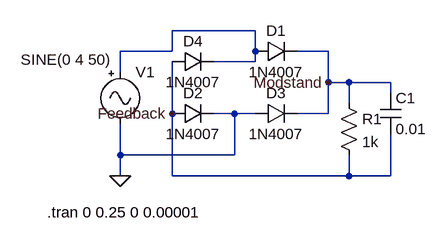
[diagram p0: schematic AEkg2.asc]
AEkg2.asc, the LTspice schematic file:
Version 4
SHEET 1 880 680
WIRE 304 64 176 64
WIRE 176 96 176 64
WIRE 176 96 96 96
WIRE 304 96 304 64
WIRE 416 96 368 96
WIRE 304 112 304 96
WIRE 304 112 240 112
WIRE 96 128 96 96
WIRE 416 144 416 96
WIRE 448 144 416 144
WIRE 512 144 448 144
WIRE 512 160 512 144
WIRE 448 176 448 144
WIRE 176 192 176 112
WIRE 272 192 240 192
WIRE 304 192 272 192
WIRE 416 192 416 144
WIRE 416 192 368 192
WIRE 96 256 96 208
WIRE 272 256 272 192
WIRE 272 256 96 256
WIRE 96 288 96 256
WIRE 176 288 176 192
WIRE 448 288 448 256
WIRE 448 288 176 288
WIRE 512 288 512 224
WIRE 512 288 448 288
FLAG 96 288 0
FLAG 176 192 Feedback
FLAG 416 144 Modstand
SYMBOL Misc\\signal 96 112 R0
WINDOW 3 -153 -3 Left 2
WINDOW 123 0 0 Left 0
WINDOW 39 0 0 Left 0
SYMATTR InstName V1
SYMATTR Value SINE(0 4 50)
SYMBOL diode 304 112 R270
WINDOW 0 32 32 VTop 2
WINDOW 3 0 32 VBottom 2
SYMATTR InstName D1
SYMATTR Value 1N4007
SYMBOL diode 176 208 R270
WINDOW 0 32 32 VTop 2
WINDOW 3 0 32 VBottom 2
SYMATTR InstName D2
SYMATTR Value 1N4007
SYMBOL diode 304 208 R270
WINDOW 0 32 32 VTop 2
WINDOW 3 0 32 VBottom 2
SYMATTR InstName D3
SYMATTR Value 1N4007
SYMBOL diode 176 128 R270
WINDOW 0 32 32 VTop 2
WINDOW 3 0 32 VBottom 2
SYMATTR InstName D4
SYMATTR Value 1N4007
SYMBOL cap 496 160 R0
SYMATTR InstName C1
SYMATTR Value 0.01
SYMBOL res 432 160 R0
SYMATTR InstName R1
SYMATTR Value 1k
TEXT -16 344 Left 2 !.tran 0 0.25 0 0.00001

The netlist it stands for:
* AEkg2.asc
V1 N001 0 SINE(0 4 50)
D1 N001 Modstand 1N4007
D2 Feedback 0 1N4007
D3 0 Modstand 1N4007
D4 Feedback N001 1N4007
C1 Modstand Feedback 0.01
R1 Modstand Feedback 1k
.model D D
.lib standard.dio
.tran 0 0.25 0 0.00001
.backanno
.end